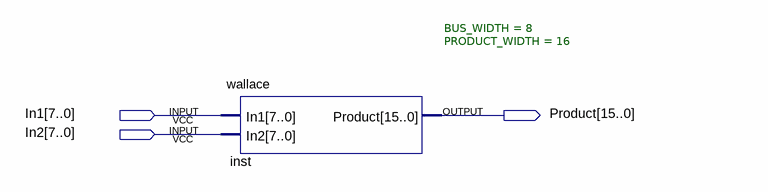
[diagram p0: schematic sheet]
// Quartus schematic wallace_test.bdf as structural Verilog: 1 symbols, 3 pins
module wallace_test (
  input  [7:0] In1,
  input  [7:0] In2,
  output [15:0] Product
);

  wallace #(.BUS_WIDTH(8), .PRODUCT_WIDTH(16)) inst (.In1(In1), .In2(In2), .Product(Product));
endmodule
